# Altium schematic sheet VL6180.SchDoc
size A4; SheetNumber: 6; SheetTotal: 7
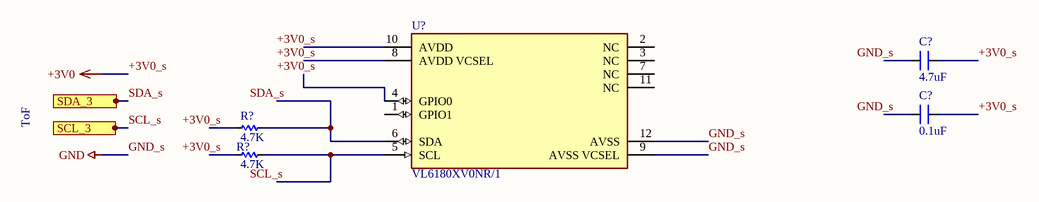
[diagram p0: VL6180.SchDoc]

## Parts
(Parts that share a designator on the sheet are numbered #1, #2 ... from top to bottom, then left to right.)
C?#1  4.7uF  [C-SE-7,5x10x9x5x4]
C?#2  0.1uF  [C-SE-7,5x10x9x5x4]
R?#1  4.7K  [RES-1/2W]
R?#2  4.7K  [RES-1/2W]
U?  VL6180XV0NR/1  [FP-VL6180XV0NR-1-MFG]

## Ports
SCL_3, SDA_3

## Nets
+3V0_s: C?#1.2 C?#2.2  [also labelled +3V0]
GND_s: U?.9(AVSS_VCSEL) U?.12(AVSS)  [also labelled GND]
SCL_s: port SCL_3
SDA_s: port SDA_3
NetR?#1_1: R?#1.1 U?.6(SDA)
NetR?#2_1: R?#2.1 U?.5(SCL)

Not connected (* = marked no-connect by the designer): C?#1 1; C?#2 1; R?#1 2; R?#2 2; U? 1(GPIO1) 2(NC) 3(NC) 4(GPIO0) 7(NC) 8(AVDD_VCSEL) 10(AVDD) 11(NC)

## Notes on the sheet
- ToF
- Labels drawn without touching a wire or pin: +3V0_s, GND_s, SCL_s, SDA_s

## Library data of the parts
C?#1 C?#2 = CN-SEMI-DIP: Capacitor (Semiconductor SIM Model); Value: 104; LatestRevisionDate: 17-Jul-2002; LatestRevisionNote: Re-released for DXP Platform.; PackageReference: C1206; Publisher: Altium Limited
R?#1 R?#2 = Res: Manufacturer: Generic Components; Class: Passive; SubClass: R; Published: 08/06/2000; Publisher: Altium Hobart Technology Centre
U? = CMP-12183-000001-1: SENSOR OPT AMBIENT 12SMD; Max Supply Voltage: 3V; Sensing Distance: 100mm; Output Type: I2C; Min Supply Voltage: 2.6V; Max Operating Temperature: 70°C; Packaging: Tape and Reel; REACH SVHC: No SVHC; Mount: Surface Mount; Number of Pins: 12; RoHS Compliant: Yes; Case/Package: LGA; Min Operating Temperature: -10°C; Lead Free: Lead Free